# Altium project WCTopping.PrjPcb
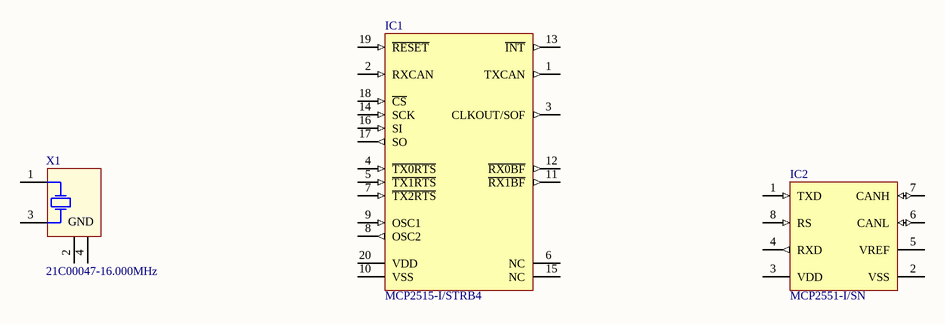
[diagram p0: CAN_Interface.SchDoc]
5 sheets, 27 parts. Net scope: flat (ports and power ports of the same name join across sheets).
Sheets:
  CAN_Interface.SchDoc
  Relay_IO.SchDoc
  Digital_IO.SchDoc
  Processor_Interface.SchDoc
  Power Supply.SchDoc

## Sheet CAN_Interface.SchDoc
size A4; SheetNumber: 1; SheetTotal: 4

### Parts
IC1  MCP2515-I/STRB4  [TSSOP-ST20_N]
IC2  MCP2551-I/SN  [MCHP-SN8_V]
X1  21C00047-16.000MHz  [ITTI-21C00047-16.000MHz-4_V]

### Nets

Not connected (* = marked no-connect by the designer): IC1 1(TXCAN) 2(RXCAN) 3(CLKOUT/SOF) 4(~{TX0RTS}) 5(~{TX1RTS}) 6(NC) 7(~{TX2RTS}) 8(OSC2) 9(OSC1) 10(VSS) 11(~{RX1BF}) 12(~{RX0BF}) 13(~{INT}) 14(SCK) 15(NC) 16(SI) 17(SO) 18(~{CS}) 19(~{RESET}) 20(VDD); IC2 1(TXD) 2(VSS) 3(VDD) 4(RXD) 5(VREF) 6(CANL) 7(CANH) 8(RS); X1 1(XTAL) 2(GND) 3(XTAL) 4(GND)

### Library data of the parts
IC1 = CMP-0186-00268-1: Stand-Alone CAN Controller With SPI Interface, 20-Pin TSSOP, Industrial Temperature; Code_JEDEC: MO-153-AC; ComponentLink2URL: http://ww1.microchip.com/downloads/en/DeviceDoc/21801F.pdf; ComponentLink3URL: http://www.microchip.com/stellent/groups/techpub_sg/documents/packagingspec/en012702.pdf; PackageReference: TSSOP-ST20; PackageDescription: 20-Lead Plastic Thin Shrink Small Outline (ST) - 4.4mm Body [TSSOP]; ComponentLink3Description: Package Specification; ComponentLink2Description: Datasheet; PackageVersion: revBB, Aug-2009; DatasheetVersion: revF, Oct-2010; ComponentLink1Description: Manufacturer URL; ComponentLink1URL: http://www.microchip.com/
IC2 = CMP-0186-00138-3: High-Speed CAN Transceiver, / 1 Mb/s, 4.5 to 5.5 V, 8-Pin SOIC (SN), Industrial Temperature, RoHS, Tube; Manufacturer: Microchip; RoHSCompliant: true; PackageReference: SN8; ComponentLink1URL: http://www.microchip.com/; DatasheetVersion: Rev. F, 07/2010; ComponentLink2Description: Datasheet; ComponentLink2URL: http://ww1.microchip.com/downloads/en/DeviceDoc/21667f.pdf; ComponentLink3Description: Package Specification; PackageDescription: 8-Pin Small Outline Integrated Circuit, Body 4.9 x 3.9 mm, Pitch 1.27 mm; ComponentLink1Description: Manufacturer URL; Mounting Technology: Surface Mount; ComponentLink3URL: http://www.microchip.com/stellent/groups/techpub_sg/documents/packagingspec/en012702.pdf
X1 = CMP-0464-00001-2: Crystal, 16 MHz, -30 to 85 degC, 3.2 x 2.5 x 0.9 mm SMD; Manufacturer: ITTI; Frequency Tolerance: +/-20 ppm; Load Capacitance: 10 pF; Drive Level: 100 max. uw; Nominal Frequency: 16 MHz; Overtone order: Fundamental; ComponentLink1Description: Manufacturer URL; PackageDescription: 4-Pin Hand Drawn, Body 3.2 x 2.5mm; ComponentLink1URL: http://www.itti-co.com; PartNumber: 21C00047-16.000MHz; Operating temperature: -30 to 85 degC; PackageReference: 21C00047-16.000MHz-4; Mounting Technology: Surface Mount; Manufacturer Part Number: 21C00047-16.000MHZ

## Sheet Relay_IO.SchDoc
size A4; SheetNumber: 2; SheetTotal: 5
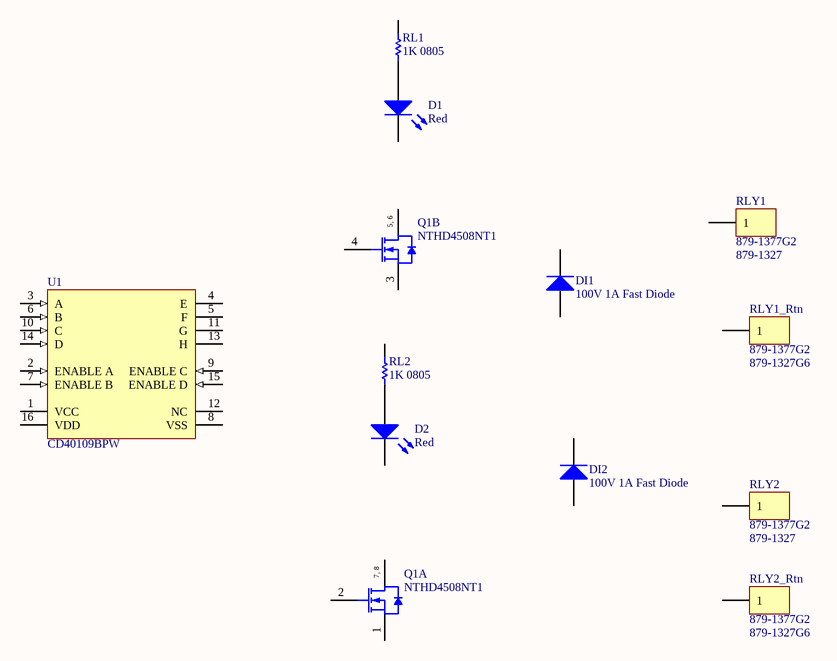
[diagram p1: Relay_IO.SchDoc]

### Parts
D1  Color: Red  [0603_A]  (hidden comment: LED Red)
D2  Color: Red  [0603_A]  (hidden comment: LED Red)
DI1  100V 1A Fast Diode  [DO-35]
DI2  100V 1A Fast Diode  [DO-35]
Q1  NTHD4508NT1  [ONSC-CHIPFET-8-1206A-03_S2_V]  (parts A,B of 2)
RL1  1K 0805  [0805_L]
RL2  1K 0805  [0805_L]
RLY1  Supplier Part Number 1: 879-1377G2  Supplier Part Number 2: 879-1327  [Anderson_Red_RHT_BOT]  (hidden comment: Anderson-1Pin RED_PCB_RHT)
RLY1_Rtn  Supplier Part Number 1: 879-1377G2  Supplier Part Number 2: 879-1327G6  [Anderson_BLK_RHT_BOT]  (hidden comment: Anderson-1Pin BLK_PCB_RHT)
RLY2  Supplier Part Number 1: 879-1377G2  Supplier Part Number 2: 879-1327  [Anderson_Red_RHT_BOT]  (hidden comment: Anderson-1Pin RED_PCB_RHT)
RLY2_Rtn  Supplier Part Number 1: 879-1377G2  Supplier Part Number 2: 879-1327G6  [Anderson_BLK_RHT_BOT]  (hidden comment: Anderson-1Pin BLK_PCB_RHT)
U1  CD40109BPW  [PW0016A_M]

### Nets
NetD1_2: D1.2(A) RL1.1
NetD2_2: D2.2(A) RL2.1
NetQ1_5: Q1.5(D2) Q1.6(D2)
NetQ1_7: Q1.7(D1) Q1.8(D1)

Not connected (* = marked no-connect by the designer): D1 1(K); D2 1(K); DI1 1(A) 2(K); DI2 1(A) 2(K); Q1 1(S1) 2(G1) 3(S2) 4(G2); RL1 2; RL2 2; RLY1 1; RLY1_Rtn 1; RLY2 1; RLY2_Rtn 1; U1 1(VCC) 2(ENABLE_A) 3(A) 4(E) 5(F) 6(B) 7(ENABLE_B) 8(VSS) 9(ENABLE_C) 10(C) 11(G) 12(NC) 13(H) 14(D) 15(ENABLE_D) 16(VDD)

### Notes on the sheet
- (in symbol CMP-1058-00039-1, part A) 7, 8
- (in symbol CMP-1058-00039-1, part B) 5, 6

### Library data of the parts
D1 D2 = LED_Red0603: SMD mono-color Chip LED, WL-SMCW, Red; Manufacturer: Wurth Electronics Inc; Manufacturer Part Number: 150060RS75000; Lens Color: Colorless; Lens Transparency: Clear; Millicandela Rating: 250mcd; Lens Style/Size: Rectangle with Flat Top, 1.10mm x 0.70mm; Voltage - Forward (Vf) (Typ): 2V; Current - Test: 20mA; Viewing Angle: 140°; Wavelength - Dominant: 625nm; Wavelength - Peak: 630nm; ComponentLink1URL: http://katalog.we-online.de/led/datasheet/150060RS75000.pdf; ComponentLink1Description: http://katalog.we-online.de/led/datasheet/150060RS75000.pdf; Supplier 1: Digi-Key; Supplier Part Number 1: 732-4978-1-ND; RoHS: RoHS Compliant; Category: Optoelectronics; Stock 1: 22059; Pricing 1: 1=0.24, 50=0.21, 100=0.192, 500=0.174, 1000=0.162 (USD); Packaging: Cut Tape (CT); Mounting Type: Surface Mount; Features: -; Package / Case: 0603 (1608 Metric); Supplier Device Package: 0603; Size / Dimension: 1.60mm L x 0.80mm W; Height (Max): 0.80mm
DI1 DI2 = Diode 1N4148: High Conductance Fast Diode; Manufacturer: ON Semiconductor; Manufacturer Part Number: MUR110RLG; Diode Case Style: DO-204AL; Diode Configuration: Single; Diode Type: Fast Recovery; Forward Surge Current Ifsm Max: 35A; Forward Voltage VF Max: 1.25V; No. of Pins: 2; Reverse Recovery Time trr Max: 75ns; SVHC: No SVHC (16-Jun-2014); Supplier 1: Ciiva; Supplier Part Number 1: MUR110RLGOSCT-ND; Stock 1: 22453; Pricing 1: 1=0.48, 10=0.362, 100=0.2254, 500=0.1541, 1000=0.1185 (USD); Forward Current If(AV): 1A; Operating Temperature Max: 175°C; Packaging: Each; Repetitive Reverse Voltage Vrrm Max: 100V; ComponentLink1URL: https://datasheet.ciiva.com/915/mur120-d-915616.pdf; ComponentLink1Description: https://datasheet.ciiva.com/915/mur120-d-915616.pdf; ComponentLink2URL: https://datasheet.ciiva.com/30479/0900766b812212ee-30479481.pdf; ComponentLink2Description: https://datasheet.ciiva.com/30479/0900766b812212ee-30479481.pdf; ComponentLink3URL: https://datasheet.ciiva.com/25950/mur120-d-25950702.pdf; ComponentLink3Description: https://datasheet.ciiva.com/25950/mur120-d-25950702.pdf; ComponentLink4URL: https://datasheet.ciiva.com/16474/mur120-d-16474333.pdf; ComponentLink4Description: https://datasheet.ciiva.com/16474/mur120-d-16474333.pdf; ComponentLink5URL: https://datasheet.ciiva.com/915/mur120-d-915618.pdf; ComponentLink5Description: https://datasheet.ciiva.com/915/mur120-d-915618.pdf; ComponentLink6URL: https://datasheet.ciiva.com/915/mur120-d-915619.pdf; ComponentLink6Description: https://datasheet.ciiva.com/915/mur120-d-915619.pdf; ComponentLink7URL: https://datasheet.ciiva.com/16208/mur120-d-16208137.pdf; ComponentLink7Description: https://datasheet.ciiva.com/16208/mur120-d-16208137.pdf
Q1 = CMP-1058-00039-1: Power MOSFET, 20 V, 4.1 A, Dual N-Channel, 8-Pin CHIPFET, Tape and Reel; Manufacturer: On Semiconductor; V(BR)DSS Min (V): 20; VGS(th) Max (V): 1.2; ID Max (A): 4.1; Ciss Typ (pF): 180; Crss Typ (pF): 25; Qrr Typ (nC): 6; Coss Typ (pF): 80; Channel Polarity: N Channel; VGS Max (V): 12; ComponentLink2URL: http://www.onsemi.com/pub_link/Collateral/NTHD4508N-D.PDF; PackageVersion: Rev. E, 10/2004; PackageReference: CHIPFET-8-1206A-03_S2; PartNumber: NTHD4508NT1; Configuration: Dual; PackageDescription: 8-Pin ChipFET, Body 3.025 x 1.625 mm, Pitch 0.635 mm; DatasheetVersion: Rev. 3; ComponentLink3Description: Package Specification; ComponentLink1URL: http://www.onsemi.com/; Package Type: ChipFET-8; ComponentLink2Description: Datasheet; Packing: Tape and Reel; ComponentLink1Description: Manufacturer URL; ComponentLink3URL: http://www.onsemi.com/pub_link/Collateral/NTHC5513-D.PDF; Mounting Technology: Surface Mount
RL1 RL2 = Res1K_0805: Manufacturer: Panasonic Electronic Components; Manufacturer Part Number: ERJ-6GEYJ102V; Tolerance: ±5%; Power (Watts): 0.125W, 1/8W; Temperature Coefficient: ±200ppm/°C; Supplier 1: Digi-Key; RoHS: RoHS Compliant; Category: Resistors; Stock 1: 1669380; Pricing 1: 1=0.1, 50=0.015, 100=0.011, 250=0.0084, 500=0.00674, 1000=0.00496 (USD); Packaging: Cut Tape (CT); Part Status: Active; Resistance (Ohms): 1k; Composition: Thick Film; Features: Automotive AEC-Q200; Operating Temperature: -55°C ~ 155°C; Package / Case: 0805 (2012 Metric); Supplier Device Package: 0805; Size / Dimension: 0.079" L x 0.049" W (2.00mm x 1.25mm); Height: 0.028" (0.70mm); Number of Terminations: 2; Failure Rate: -; ComponentLink1URL: http://industrial.panasonic.com/www-cgi/jvcr13pz.cgi?E+PZ+3+AOA0001+ERJ6GEYJ102V+7+WW; ComponentLink1Description: http://industrial.panasonic.com/www-cgi/jvcr13pz.cgi?E+PZ+3+AOA0001+ERJ6GEYJ102V+7+WW; Supplier Part Number 1: P1.0KACT-ND
RLY1 RLY2 = Anderson-1Pin RED_PCB_RHT: 1 pin Anderson; Manufacturer: Anderson Power Products (APP); Manufacturer Part Number: 1377G1, 1377G2, 1327-BK,137G6-BK; Number of Positions / Contacts: 1; Voltage Rating: 600 V; Current Rating: 25 A; Mouser: 879-1327G6; Mouser: 879-1327; Mouser: 879-1377G2; Mouser: 879-1377G1; Supplier 1: Mouser; Stock 1: 233; Pricing 1: 1=1.14, 10=1.14, 50=0.947, 100=0.901, 1000=0.777, 10000=0.777 (USD); Termination Style: Solder; Series: PCB Powerpole; Product Type: Contacts; Contact Material: Copper Alloy; Contact Plating: Tin; ComponentLink1URL: http://components.arrow.com/part/dataview/0323_01933244; ComponentLink1Description: http://components.arrow.com/part/dataview/0323_01933244; ComponentLink2URL: http://www.andersonpower.com/files.php?file=CAT-PPMP(4).pdf; ComponentLink2Description: http://www.andersonpower.com/files.php?file=CAT-PPMP(4).pdf
RLY1_Rtn RLY2_Rtn = Anderson-1Pin BLK_PCB_RHT: 1 pin Anderson; Manufacturer: Anderson Power Products (APP); Manufacturer Part Number: 1377G1, 1377G2, 1327-BK,137G6-BK; Number of Positions / Contacts: 1; Voltage Rating: 600 V; Current Rating: 25 A; Mouser: 879-1327G6; Mouser: 879-1327; Mouser: 879-1377G2; Mouser: 879-1377G1; Supplier 1: Mouser; Stock 1: 233; Pricing 1: 1=1.14, 10=1.14, 50=0.947, 100=0.901, 1000=0.777, 10000=0.777 (USD); Termination Style: Solder; Series: PCB Powerpole; Product Type: Contacts; Contact Material: Copper Alloy; Contact Plating: Tin; ComponentLink1URL: http://components.arrow.com/part/dataview/0323_01933244; ComponentLink1Description: http://components.arrow.com/part/dataview/0323_01933244; ComponentLink2URL: http://www.andersonpower.com/files.php?file=CAT-PPMP(4).pdf; ComponentLink2Description: http://www.andersonpower.com/files.php?file=CAT-PPMP(4).pdf
U1 = CMP-1527-00010-2: CMOS Quad Low-to-High Voltage Level Shifter, 3 to 18 V, -55 to 125 degC, 16-Pin TSSOP (PW16), RoHS, Tube; Manufacturer: Texas Instruments; Number of Bits: 4; VSS: 3 to 18 V; Propagation Delay: 240 ns Max.; PackageDescription: 16-Pin Plastic Small Outline Package, Body 5 x 4.4 mm, Pitch 0.65 mm; ComponentLink3URL: http://www.ti.com/lit/ml/mpds361/mpds361.pdf; Package Reference: PW0016A; ComponentLink2URL: http://www.ti.com/lit/ds/symlink/cd40109b.pdf; RoHS: TRUE; ComponentLink1URL: www.ti.com; ComponentLink1Description: Manufacturer URL; PackageVersion: 4040064-4/G; Number of Channels: 4; PartNumber: CD40109BPW; DatasheetVersion: SCHS099B; Number of Outputs: 4; ComponentLink3Description: Package Specification; ComponentLink2Description: Datasheet; Mounting Technology: Surface Mount; Packing: Tube; Temperature Range: -55 to 125 degC

## Sheet Digital_IO.SchDoc
size A4; SheetNumber: 3; SheetTotal: 4

## Sheet Processor_Interface.SchDoc
size A4; SheetNumber: 4; SheetTotal: 5
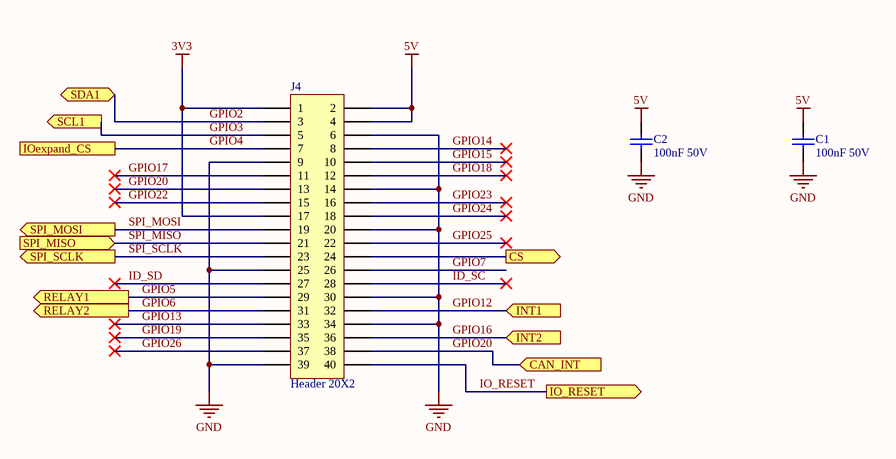
[diagram p2: Processor_Interface.SchDoc]

### Parts
C1  100nF 50V  [0603C_L]
C2  100nF 50V  [0603C_L]
J4  Header 20X2  [HDR2X20]

### Ports
CAN_INT (in), CS (out), INT1 (in), INT2 (in), IO_RESET (out), IOexpand_CS, RELAY1 (out), RELAY2 (out), SCL1 (out), SDA1 (bidir), SPI_MISO (in), SPI_MOSI (out), SPI_SCLK (out)

### Nets
3V3: J4.1 J4.17
5V: C1.2 C2.2 J4.2 J4.4
GND: C1.1 C2.1 J4.6 J4.9 J4.14 J4.20 J4.25 J4.30 J4.34 J4.39
GPIO2: J4.3 ; port SDA1
GPIO3: J4.5 ; port SCL1
GPIO4: J4.7 ; port IOexpand_CS
GPIO5: J4.29 ; port RELAY1
GPIO6: J4.31 ; port RELAY2
GPIO7: J4.26
GPIO12: J4.32 ; port INT1
GPIO13: J4.33
GPIO14: J4.8
GPIO15: J4.10
GPIO16: J4.36 ; port INT2
GPIO17: J4.11
GPIO18: J4.12
GPIO19: J4.35
GPIO20: J4.13 J4.38 ; port CAN_INT
GPIO22: J4.15
GPIO23: J4.16
GPIO24: J4.18
GPIO25: J4.22
GPIO26: J4.37
ID_SC: J4.28
ID_SD: J4.27
IO_RESET: J4.40 ; port IO_RESET
SPI_MISO: J4.21 ; port SPI_MISO
SPI_MOSI: J4.19 ; port SPI_MOSI
SPI_SCLK: J4.23 ; port SPI_SCLK
NetJ4_24: J4.24 ; port CS

### Library data of the parts
C1 C2 = Cap100nF_50V_0603: Manufacturer: Yageo; Manufacturer Part Number: CC0603ZRY5V9BB104; Capacitance: 0.10µF; Tolerance: -20%, +80%; Temperature Coefficient: Y5V (F); Supplier 1: Digi-Key; Supplier Part Number 1: 311-1343-1-ND; RoHS: RoHS Compliant; Category: Capacitors; Stock 1: 1827128; Pricing 1: 1=0.1, 10=0.018, 25=0.0128, 100=0.0082, 250=0.00672, 500=0.00574, 1000=0.00447 (USD); Packaging: Cut Tape (CT); Part Status: Active; Voltage - Rated: 50V; Operating Temperature: -30°C ~ 85°C; Features: -; Ratings: -; Applications: General Purpose; Failure Rate: -; Mounting Type: Surface Mount, MLCC; Package / Case: 0603 (1608 Metric); Size / Dimension: 0.063" L x 0.031" W (1.60mm x 0.80mm); Height - Seated (Max): -; Thickness (Max): 0.035" (0.90mm); Lead Spacing: -; Lead Style: -; ComponentLink1URL: http://www.yageo.com/documents/recent/UPY-GPHC_Y5V_6.3V-to-50V_6.pdf; ComponentLink1Description: http://www.yageo.com/documents/recent/UPY-GPHC_Y5V_6.3V-to-50V_6.pdf
J4 = Header 20X2: Header, 20-Pin, Dual row; LatestRevisionDate: 17-Jul-2002; LatestRevisionNote: Re-released for DXP Platform.; Publisher: Altium Limited

## Sheet Power Supply.SchDoc: Power Supplies: 5V @ 5A; 3.3V @1A
size A; Engineer: H Potential; DocumentNumber: 5; Revision: 3.4; SheetNumber: 5; SheetTotal: 5
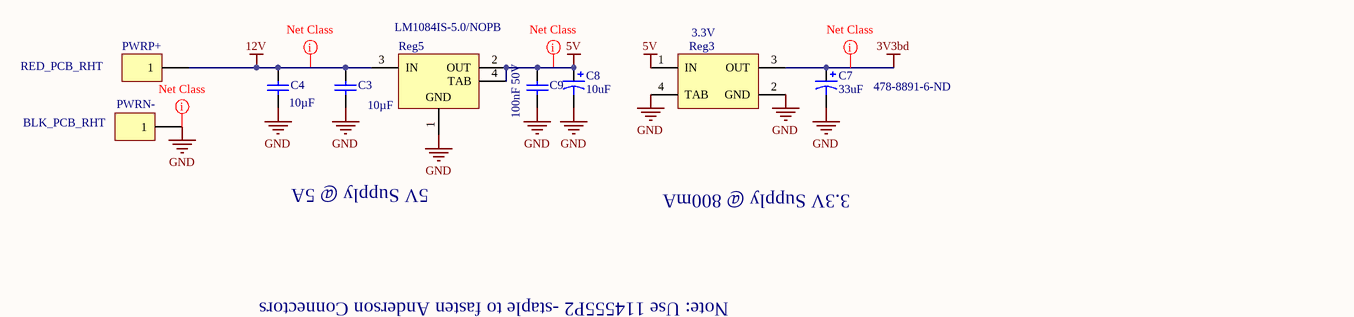
[diagram p3: Power Supply.SchDoc]

### Parts
C3  10µF  [CAPC2013X135X45ML10T25]
C4  10µF  [CAPC2013X135X45ML10T25]
C7  33uF  Supplier Part Number 1: 478-8891-6-ND  [AVX-CAPC3528_V]
C8  10uF  [AVX-CAPC3528_V]
C9  100nF 50V  [0603C_L]
PWRN-  BLK_PCB_RHT  [Anderson_BLK_RHT_BOT]
PWRP+  RED_PCB_RHT  [Anderson_Red_RHT_BOT]
Reg3  3.3V  [DCY0004A_M]
Reg5  LM1084IS-5.0/NOPB  [KTT0003B_L]

### Nets
3V3bd: C7.1 Reg3.3(OUT)
5V: C8.1 C9.2 Reg3.1(IN) Reg5.2(OUT) Reg5.4(TAB)
12V: C3.2 C4.2 PWRP+.1 Reg5.3(IN)
GND: C3.1 C4.1 C7.2 C8.2 C9.1 PWRN-.1 Reg3.2(GND) Reg3.4(TAB) Reg5.1(GND)

### Layout directives
net class PowerNets: 3V3bd, 5V, 12V, GND

### Notes on the sheet
- 5V Supply @ 5A
- 3.3V Supply @ 800mA
- Note: Use 114555P2 -staple to fasten Anderson Connectors
- Title
- Size:
- Date:
- A
- Project:
- Time:
- Revision:
- Sheet
- of
- Engineer:
- File:

### Library data of the parts
C3 C4 = CMP-2007-03541-1: Part Number: GRM21BR61E106KA73L; Manufacturer: Murata; Product Training Modules: High-Cap Multilayer Ceramic Capacitors; Catalog Drawings: GRM Series_0805_1.25; Tolerance: ±10%; Voltage - Rated: 25V; Temperature Coefficient: X5R; Online Catalog: GRM Series; Other Names: 490-5523-6; Supplier 1: Digikey; Supplier Part Number 1: 490-5523-1-ND; Manufacturer Part Number: GRM21BR61E106KA73L; Stock 1: 750766; Pricing 1: 1=0.19, 10=0.13, 50=0.0748, 100=0.0618, 250=0.052, 500=0.0436, 1000=0.0358 (USD); Standard Package: 1; Category: Capacitors; Family: Ceramic Capacitors; Series: GRM; Packaging: Digi-Reel®; Capacitance: 10µF; Mounting Type: Surface Mount, MLCC; Operating Temperature: -55°C ~ 85°C; Applications: General Purpose; Ratings: -; Package / Case: 0805 (2012 Metric); Size / Dimension: 0.079" L x 0.049" W (2.00mm x 1.25mm); Height - Seated (Max): -; Thickness (Max): 0.053" (1.35mm); Lead Spacing: -; Features: -; Lead Style: -; ComponentLink1URL: https://datasheet.ciiva.com/139/partnumbering-e-01-139184.pdf; ComponentLink1Description: https://datasheet.ciiva.com/139/partnumbering-e-01-139184.pdf; ComponentLink2URL: https://datasheet.ciiva.com/28584/626718-28584288.pdf; ComponentLink2Description: https://datasheet.ciiva.com/28584/626718-28584288.pdf; ComponentLink3URL: https://datasheet.ciiva.com/16440/grm21br61e106ka73l-16440627.pdf; ComponentLink3Description: https://datasheet.ciiva.com/16440/grm21br61e106ka73l-16440627.pdf; ComponentLink4URL: https://datasheet.ciiva.com/7719/1747469-7719093.pdf; ComponentLink4Description: https://datasheet.ciiva.com/7719/1747469-7719093.pdf; ComponentLink5URL: https://datasheet.ciiva.com/5424/product-5424327.pdf; ComponentLink5Description: https://datasheet.ciiva.com/5424/product-5424327.pdf; ComponentLink6URL: https://datasheet.ciiva.com/28584/626718-28584279.pdf; ComponentLink6Description: https://datasheet.ciiva.com/28584/626718-28584279.pdf; ComponentLink7URL: https://datasheet.ciiva.com/14116/grmseries-highdielectrictype-eng-14116376.pdf; ComponentLink7Description: https://datasheet.ciiva.com/14116/grmseries-highdielectrictype-eng-14116376.pdf; ComponentLink8URL: https://datasheet.ciiva.com/22774/1747469-22774396.pdf; ComponentLink8Description: https://datasheet.ciiva.com/22774/1747469-22774396.pdf; ComponentLink9URL: https://datasheet.ciiva.com/139/partnumbering-e-01-139182.pdf; ComponentLink9Description: https://datasheet.ciiva.com/139/partnumbering-e-01-139182.pdf; ComponentLink10URL: https://datasheet.ciiva.com/139/partnumbering-e-01-139183.pdf; ComponentLink10Description: https://datasheet.ciiva.com/139/partnumbering-e-01-139183.pdf; ComponentLink11URL: https://datasheet.ciiva.com/29199/454623-da-01-en-vs-kondensator-0805-29199615.pdf; ComponentLink11Description: https://datasheet.ciiva.com/29199/454623-da-01-en-vs-kondensator-0805-29199615.pdf
C7 = CMP-0279-00001-1: Capacitor, Tantalum, 10uF 10% 20V MCCT-B (3528); Manufacturer: Kyocera / AVX; Manufacturer Part Number: TAJB336K006RNJ; PCN Part Number: TAJ Series Suffix 08/Dec/2008; Manufacturer Size Code: B; Product Training Modules: Component Solutions for Smart Meter Applications; Catalog Drawings: TAJ Series Side / TAJ Series; Voltage - Rated: 6.3V; Type: Molded; Dynamic Catalog: TAJ Series; Other Names: 478-8891-6; Capacitance: 33uF; Supplier 1: Digikey; Stock 1: 0; Pricing 1: 1=0.67, 10=0.476, 25=0.4064, 50=0.36, 100=0.3136, 250=0.2671, 500=0.2323, 1000=0.1974 (USD); Failure Rate: General Purpose; Standard Package: 1; Category: Capacitors; Family: Tantalum Capacitors; Series: TAJ; Packaging: Digi-Reel®; Tolerance: ±10%; ESR (Equivalent Series Resistance): -; Operating Temperature: -55°C ~ 125°C; Mounting Type: Surface Mount; Package / Case: 1210 (3528 Metric); Size / Dimension: 0.138" L x 0.110" W (3.50mm x 2.80mm); Height - Seated (Max): 0.083" (2.10mm); Lead Spacing: -; Features: General Purpose; Lifetime @ Temp.: -; ComponentLink1URL: https://datasheet.ciiva.com/11793/0900766b80ccdc61-11793299.pdf; ComponentLink1Description: https://datasheet.ciiva.com/11793/0900766b80ccdc61-11793299.pdf; ComponentLink2URL: https://datasheet.ciiva.com/7775/1680476-7775701.pdf; ComponentLink2Description: https://datasheet.ciiva.com/7775/1680476-7775701.pdf; ComponentLink3URL: https://datasheet.ciiva.com/7775/1680476-7775702.pdf; ComponentLink3Description: https://datasheet.ciiva.com/7775/1680476-7775702.pdf; ComponentLink4URL: https://datasheet.ciiva.com/7775/1680476-7775703.pdf; ComponentLink4Description: https://datasheet.ciiva.com/7775/1680476-7775703.pdf; ComponentLink5URL: https://datasheet.ciiva.com/28516/taj-28516106.pdf; ComponentLink5Description: https://datasheet.ciiva.com/28516/taj-28516106.pdf; ComponentLink6URL: https://datasheet.ciiva.com/12884/taj-27497-12884571.pdf; ComponentLink6Description: https://datasheet.ciiva.com/12884/taj-27497-12884571.pdf; ComponentLink7URL: https://datasheet.ciiva.com/29504/taj-29504347.pdf; ComponentLink7Description: https://datasheet.ciiva.com/29504/taj-29504347.pdf; ComponentLink8URL: https://datasheet.ciiva.com/29504/taj-29504348.pdf; ComponentLink8Description: https://datasheet.ciiva.com/29504/taj-29504348.pdf; ComponentLink9URL: https://datasheet.ciiva.com/29504/taj-29504349.pdf; ComponentLink9Description: https://datasheet.ciiva.com/29504/taj-29504349.pdf; ComponentLink10URL: https://datasheet.ciiva.com/16492/taj-16492862.pdf; ComponentLink10Description: https://datasheet.ciiva.com/16492/taj-16492862.pdf
C8 = CMP-0279-00001-1: Capacitor, Tantalum, 10uF 10% 20V MCCT-B (3528); PartNumber: TAJB106K020R; Manufacturer: AVX; Manufacturer Part Number: TAJB106K020RNJ; Polarity: Polarized; Case Style: Molded; DCL: 2 uA; DF: 6%; ESR: 2.1 ohm; Insulation: Not Required; Lead Spacing (nom): Not Required mm; Product Depth (mm): 2.8 mm; Product Height (mm): 1.9 mm; Product Length (mm): 3.5 mm; Rad Hardened: No; Voltage: 20VDC; PackageDescription: 2-Pin SMT Capacitor, 3.5 x 2.8 mm Body; ComponentLink1URL: http://www.avx.com/; PackageReference: CAPC3528; ComponentLink2Description: Datasheet; Capacitance: 10uF; Technology: Tantalum; ComponentLink2URL: http://www.avx.com/docs/Catalogs/taj.pdf; Tolerance: 10%; ComponentLink1Description: Manufacturer URL; Rated Voltage: 20V; DatasheetVersion: Jun-13; Mounting Technology: Surface Mount; Supplier 1: Digikey; Supplier Part Number 1: 478-1674-6-ND; Stock 1: 65037; Pricing 1: 1=0.65, 10=0.459, 25=0.392, 50=0.3472, 100=0.3024, 250=0.2576, 500=0.224, 1000=0.1904 (USD); Case Code: B; Construction: SMT Chip; Failure Rate: Not Required; Length W/Weld: Not Required mm; Length W/Weld (max): Not Required mm; Mounting Style: Surface Mount; Operating Temp Range: -55C to 125C; Package / Case: 3528-21; Packaging: Tape and Reel; Product Diameter (mm): Not Required mm; Seal: Not Required; Seated Plane Height: Not Required mm; Tolerance (+ or -): 10%; Wire Form: Not Required; ComponentLink3URL: https://datasheet.ciiva.com/11793/0900766b80ccdc61-11793072.pdf; ComponentLink3Description: https://datasheet.ciiva.com/11793/0900766b80ccdc61-11793072.pdf; ComponentLink4URL: https://datasheet.ciiva.com/14586/70001050-14586940.pdf; ComponentLink4Description: https://datasheet.ciiva.com/14586/70001050-14586940.pdf; ComponentLink5URL: https://datasheet.ciiva.com/16485/taj-16485899.pdf; ComponentLink5Description: https://datasheet.ciiva.com/16485/taj-16485899.pdf; ComponentLink6URL: https://datasheet.ciiva.com/5936/13070-5936843.pdf; ComponentLink6Description: https://datasheet.ciiva.com/5936/13070-5936843.pdf; ComponentLink7URL: https://datasheet.ciiva.com/3004/taj-3004427.pdf; ComponentLink7Description: https://datasheet.ciiva.com/3004/taj-3004427.pdf; ComponentLink8URL: https://datasheet.ciiva.com/16393/taj-16393850.pdf; ComponentLink8Description: https://datasheet.ciiva.com/16393/taj-16393850.pdf; ComponentLink9URL: https://datasheet.ciiva.com/3004/taj-3004426.pdf; ComponentLink9Description: https://datasheet.ciiva.com/3004/taj-3004426.pdf; ComponentLink10URL: https://datasheet.ciiva.com/18710/taj-eng-18710633.pdf; ComponentLink10Description: https://datasheet.ciiva.com/18710/taj-eng-18710633.pdf; ComponentLink11URL: https://datasheet.ciiva.com/12882/taj-27497-12882702.pdf; ComponentLink11Description: https://datasheet.ciiva.com/12882/taj-27497-12882702.pdf; ComponentLink12URL: https://datasheet.ciiva.com/7730/1826076-7730729.pdf; ComponentLink12Description: https://datasheet.ciiva.com/7730/1826076-7730729.pdf; ComponentLink13URL: https://datasheet.ciiva.com/14602/70001050-14602487.pdf; ComponentLink13Description: https://datasheet.ciiva.com/14602/70001050-14602487.pdf; ComponentLink14URL: https://datasheet.ciiva.com/7730/1826076-7730727.pdf; ComponentLink14Description: https://datasheet.ciiva.com/7730/1826076-7730727.pdf; ComponentLink15URL: https://datasheet.ciiva.com/26341/559425-da-01-en-tacc-b-3-2-mm-x-2-5-mm-x-1-9-mm-10-uf-26341766.pdf; ComponentLink15Description: https://datasheet.ciiva.com/26341/559425-da-01-en-tacc-b-3-2-mm-x-2-5-mm-x-1-9-mm-10-uf-26341766.pdf; ComponentLink16URL: https://datasheet.ciiva.com/7730/1826076-7730726.pdf; ComponentLink16Description: https://datasheet.ciiva.com/7730/1826076-7730726.pdf; ComponentLink17URL: https://datasheet.ciiva.com/263/taj-263492.pdf; ComponentLink17Description: https://datasheet.ciiva.com/263/taj-263492.pdf; ComponentLink18URL: https://datasheet.ciiva.com/263/taj-263491.pdf; ComponentLink18Description: https://datasheet.ciiva.com/263/taj-263491.pdf; ComponentLink19URL: https://datasheet.ciiva.com/263/taj-263490.pdf; ComponentLink19Description: https://datasheet.ciiva.com/263/taj-263490.pdf; ComponentLink20URL: https://datasheet.ciiva.com/7730/1826076-7730728.pdf; ComponentLink20Description: https://datasheet.ciiva.com/7730/1826076-7730728.pdf; ComponentLink21URL: https://datasheet.ciiva.com/26787/tajb106k020rnj-26787086.pdf; ComponentLink21Description: https://datasheet.ciiva.com/26787/tajb106k020rnj-26787086.pdf
C9 = Cap100nF_50V_0603: as C1 on sheet Processor_Interface; Supplier 1: Digi-Key; Supplier Part Number 1: 311-1343-1-ND; RoHS: RoHS Compliant; Category: Capacitors; Stock 1: 1827128; Pricing 1: 1=0.1, 10=0.018, 25=0.0128, 100=0.0082, 250=0.00672, 500=0.00574, 1000=0.00447 (USD); Packaging: Cut Tape (CT); Part Status: Active; Voltage - Rated: 50V; Operating Temperature: -30°C ~ 85°C; Features: -; Ratings: -; Applications: General Purpose; Failure Rate: -; Mounting Type: Surface Mount, MLCC; Package / Case: 0603 (1608 Metric); Size / Dimension: 0.063" L x 0.031" W (1.60mm x 0.80mm); Height - Seated (Max): -; Thickness (Max): 0.035" (0.90mm); Lead Spacing: -; Lead Style: -; ComponentLink1URL: http://www.yageo.com/documents/recent/UPY-GPHC_Y5V_6.3V-to-50V_6.pdf; ComponentLink1Description: http://www.yageo.com/documents/recent/UPY-GPHC_Y5V_6.3V-to-50V_6.pdf
PWRN- = Anderson-1Pin BLK_PCB_RHT: as RLY1_Rtn on sheet Relay_IO; Mouser: 879-1327G6; Mouser: 879-1327; Mouser: 879-1377G2; Mouser: 879-1377G1; Supplier 1: Mouser; Stock 1: 233; Pricing 1: 1=1.14, 10=1.14, 50=0.947, 100=0.901, 1000=0.777, 10000=0.777 (USD); Termination Style: Solder; Series: PCB Powerpole; Product Type: Contacts; Contact Material: Copper Alloy; Contact Plating: Tin; ComponentLink1URL: http://components.arrow.com/part/dataview/0323_01933244; ComponentLink1Description: http://components.arrow.com/part/dataview/0323_01933244; ComponentLink2URL: http://www.andersonpower.com/files.php?file=CAT-PPMP(4).pdf; ComponentLink2Description: http://www.andersonpower.com/files.php?file=CAT-PPMP(4).pdf; Supplier Part Number 2: 879-1377G2; Supplier Part Number 1: 879-1377G1; Supplier Part Number 3: 879-1327G6; Supplier Part Number 4: 879-1327
PWRP+ = Anderson-1Pin RED_PCB_RHT: as RLY1 on sheet Relay_IO; Mouser: 879-1327G6; Mouser: 879-1327; Mouser: 879-1377G2; Mouser: 879-1377G1; Supplier 1: Mouser; Stock 1: 233; Pricing 1: 1=1.14, 10=1.14, 50=0.947, 100=0.901, 1000=0.777, 10000=0.777 (USD); Termination Style: Solder; Series: PCB Powerpole; Product Type: Contacts; Contact Material: Copper Alloy; Contact Plating: Tin; ComponentLink1URL: http://components.arrow.com/part/dataview/0323_01933244; ComponentLink1Description: http://components.arrow.com/part/dataview/0323_01933244; ComponentLink2URL: http://www.andersonpower.com/files.php?file=CAT-PPMP(4).pdf; ComponentLink2Description: http://www.andersonpower.com/files.php?file=CAT-PPMP(4).pdf; Supplier Part Number 2: 879-1377G2; Supplier Part Number 1: 879-1377G1; Supplier Part Number 3: 879-1327G6; Supplier Part Number 4: 879-1327
Reg3 = CMP-0062-01788-3: 1A Low Dropout Regulator for 5V to 3.3V Conversion, 4-pin SOT-223, Pb-Free; Manufacturer: Texas Instruments; Manufacturer Part Number: LM3940IMP-3.3/NOPB; PowerWise: N; CompType: LDO IC; PackageTopMarking: XYTT*L52B; Voltage Regulator Type: LDO; Regulator Output Type: Fixed; Polarity Type: Positive; Number of Outputs: 1; Input Voltage (Min): 4.5V; Input Voltage: 7.5V; Load Regulation: 50mV; Line Regulation: 40mV; Dropout Voltage@Current (Typ): 0.5@1A/0.11@100mA; Quiescent Current (Max): 15mA; PackageDescription: Molded SOT-223, 6.50 x 3.56 x 1.6mm Body, 4 Lead, 2.3mm Pitch; ComponentLink1URL: http://www.ti.com/general/docs/lit/getliterature.tsp?genericPartNumber=LM3940&fileType=pdf; PackageReference: DCY0004A; RoHS: Y; ComponentLink1Description: Datasheet URL; PinCount: 4; Code_JEDEC: TO-261-AA; Code_IPC: SOT223-4; Supplier 1: Digikey; Supplier Part Number 1: LM3940IMP-3.3/NOPBDKR-ND; Stock 1: 22816; Pricing 1: 1=1.49, 10=1.332, 100=1.0381, 500=0.8585 (USD); Topology: LDO; Output Voltage: 3.3V; Package Type: SOT-223; Packaging: Tape and Reel; Output Current: 1A; Operating Temp Range: -40C to 125C; Operating Temperature Classification: Automotive; Pin Count: 3 +Tab; Mounting: Surface Mount; ComponentLink2URL: https://datasheet.ciiva.com/48433/elnatsemico-spanungsregler-ldo-lm3940-en-48433415.pdf; ComponentLink2Description: https://datasheet.ciiva.com/48433/elnatsemico-spanungsregler-ldo-lm3940-en-48433415.pdf; ComponentLink3URL: https://datasheet.ciiva.com/49046/1896170-49046286.pdf; ComponentLink3Description: https://datasheet.ciiva.com/49046/1896170-49046286.pdf; ComponentLink4URL: https://datasheet.ciiva.com/46384/1882650-46384431.pdf; ComponentLink4Description: https://datasheet.ciiva.com/46384/1882650-46384431.pdf
Reg5 = CMP-0062-00575-4: 5A Low Dropout Positive Regulators, 3-pin TO-263, Pb-Free; Manufacturer: Texas Instruments; PowerWise: N; PackageTopMarking: NSUZXYTTE#*LM1084*IS-5.0; High-Reliability: Y; CompType: LDO IC; ComponentLink1Description: Datasheet URL; PackageDescription: TO-263, Molded, .400 x .390 x .180in, 3 Lead, .1in Pitch, Surface Mount; RoHS: Y; PackageReference: KTT0003B; PinCount: 3; Code_JEDEC: MO-169-AA; PartNumber: LM1084IS-5.0/NOPB; ComponentLink1URL: http://www.ti.com/general/docs/lit/getliterature.tsp?genericPartNumber=LM1084&fileType=pdf

## Nets that join several sheets
5V: Processor_Interface (C1.2 C2.2 J4.2 J4.4), Power Supply (5 pins)
GND: Processor_Interface (10 pins), Power Supply (9 pins)